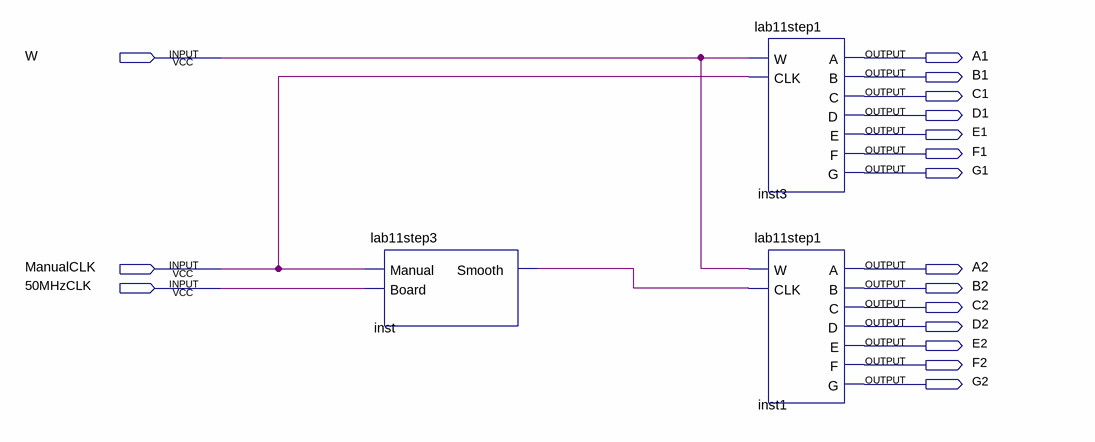
[diagram p0: schematic sheet]
// Quartus schematic lab11step4.bdf as structural Verilog: 3 symbols, 17 pins
module lab11step4 (
  input  W,
  input  ManualCLK,
  input  \50MHzCLK ,
  output A1,
  output B1,
  output C1,
  output D1,
  output E1,
  output F1,
  output G1,
  output A2,
  output B2,
  output C2,
  output D2,
  output E2,
  output F2,
  output G2
);

  wire inst_smooth;

  lab11step3 inst (.Manual(ManualCLK), .Board(\50MHzCLK ), .Smooth(inst_smooth));
  lab11step1 inst3 (.W(W), .CLK(ManualCLK), .A(A1), .B(B1), .C(C1), .D(D1), .E(E1), .F(F1), .G(G1));
  lab11step1 inst1 (.W(W), .CLK(inst_smooth), .A(A2), .B(B2), .C(C2), .D(D2), .E(E2), .F(F2), .G(G2));
endmodule
